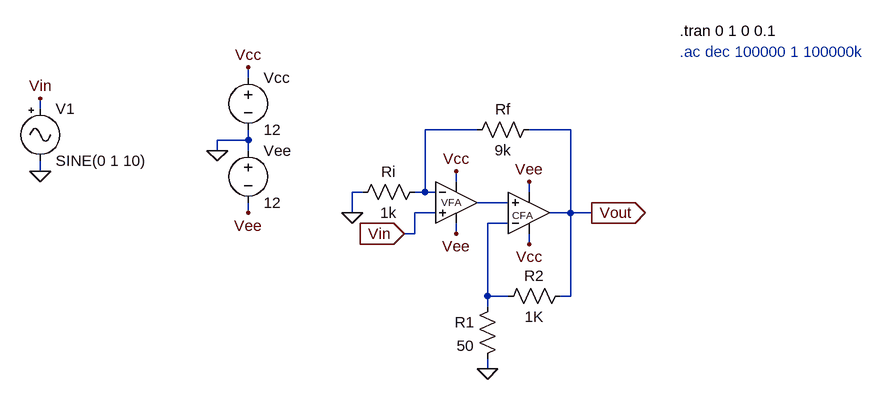
[diagram p0: schematic VFA-CFA.asc]
VFA-CFA.asc, the LTspice schematic file:
Version 4.1
SHEET 1 1076 680
WIRE 48 -80 48 -96
WIRE -272 -32 -272 -48
WIRE 400 0 320 0
WIRE 544 0 480 0
WIRE 48 16 48 0
WIRE 48 16 0 16
WIRE 0 32 0 16
WIRE 48 32 48 16
WIRE -272 64 -272 48
WIRE 368 80 368 64
WIRE 224 96 208 96
WIRE 320 96 320 0
WIRE 320 96 304 96
WIRE 336 96 320 96
WIRE 480 96 480 80
WIRE 448 112 400 112
WIRE 48 128 48 112
WIRE 208 128 208 96
WIRE 336 128 304 128
WIRE 544 128 544 0
WIRE 544 128 512 128
WIRE 576 128 544 128
WIRE 448 144 416 144
WIRE 304 160 304 128
WIRE 304 160 288 160
WIRE 368 160 368 144
WIRE 480 176 480 160
WIRE 416 256 416 144
WIRE 448 256 416 256
WIRE 544 256 544 128
WIRE 544 256 528 256
WIRE 416 272 416 256
WIRE 416 368 416 352
FLAG 0 32 0
FLAG 48 -96 Vcc
FLAG 48 128 Vee
FLAG 208 128 0
FLAG 576 128 Vout
IOPIN 576 128 Out
FLAG -272 -48 Vin
FLAG 480 176 Vcc
FLAG 480 80 Vee
FLAG 368 64 Vcc
FLAG 368 160 Vee
FLAG 416 368 0
FLAG -272 64 0
FLAG 288 160 Vin
IOPIN 288 160 In
SYMBOL res 320 80 R90
WINDOW 0 0 56 VBottom 2
WINDOW 3 32 56 VTop 2
SYMATTR InstName Ri
SYMATTR Value 1k
SYMBOL res 496 -16 R90
WINDOW 0 0 56 VBottom 2
WINDOW 3 32 56 VTop 2
SYMATTR InstName Rf
SYMATTR Value 9k
SYMBOL voltage 48 -96 R0
WINDOW 123 0 0 Left 0
WINDOW 39 0 0 Left 0
SYMATTR InstName Vcc
SYMATTR Value 12
SYMBOL voltage 48 16 R0
WINDOW 123 0 0 Left 0
WINDOW 39 0 0 Left 0
SYMATTR InstName Vee
SYMATTR Value 12
SYMBOL res 432 256 M0
SYMATTR InstName R1
SYMATTR Value 50
SYMBOL res 544 240 R90
WINDOW 0 0 56 VBottom 2
WINDOW 3 32 56 VTop 2
SYMATTR InstName R2
SYMATTR Value 1K
SYMBOL Misc\\signal -272 -48 R0
WINDOW 39 0 0 Left 0
SYMATTR InstName V1
SYMATTR Value SINE(0 1 10)
SYMATTR Value2 AC 1
SYMBOL LM6181 480 128 M180
WINDOW 0 -10 7 Bottom 1
WINDOW 3 8 56 Invisible 2
SYMATTR InstName CFA
SYMBOL LM324 368 112 R0
WINDOW 0 -8 10 Bottom 1
WINDOW 3 0 56 Invisible 2
SYMATTR InstName VFA
TEXT 712 -152 Left 2 !.tran 0 1 0 0.1
TEXT 712 -120 Left 2 ;.ac dec 100000 1 100000k

The netlist it stands for:
* VFA-CFA.asc
Ri N001 0 1k
Rf Vout N001 9k
Vcc Vcc 0 12
Vee 0 Vee 12
R1 N003 0 50
R2 Vout N003 1K
V1 Vin 0 SINE(0 1 10) AC 1
* CFA: LM6181 (symbol LM6181 not available, pins judged from their places): In+=N002 In-=N003 V+=Vcc V-=Vee OUT=Vout
* VFA: LM324 (symbol LM324 not available, pins judged from their places): In+=Vin In-=N001 V+=Vcc V-=Vee OUT=N002
.tran 0 1 0 0.1
* .ac dec 100000 1 100000k
.backanno
.end